# Altium schematic sheet CAN Communication.SchDoc
size A4; SheetNumber: 5; SheetTotal: 7
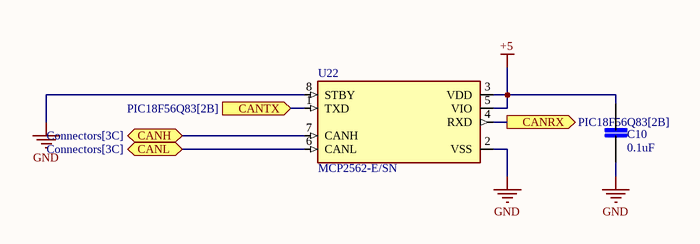
[diagram p0: CAN Communication.SchDoc]

## Parts
C10  0.1uF  [0805]
U22  MCP2562-E/SN  [MCP2562-E/SN]

## Ports
CANH (bidir, see Connectors[3C]), CANL (bidir, see Connectors[3C]), CANRX (out, see PIC18F56Q83[2B]), CANTX (in, see PIC18F56Q83[2B])

## Nets
+5: C10.2 U22.3(VDD) U22.5(VIO)
GND: C10.1 U22.2(VSS) U22.8(STBY)
CANH: U22.7(CANH) ; port CANH
CANL: U22.6(CANL) ; port CANL
CANRX: U22.4(RXD) ; port CANRX
CANTX: U22.1(TXD) ; port CANTX

## Library data of the parts
C10 = 0805_Capacitor: MP: LD051A121KAB2A; MF: AVX; SnapEDA_Link: https://www.snapeda.com/parts/LD051A121KAB2A/AVX/view-part/?ref=snap; Package: 0805 AVX; Check_prices: https://www.snapeda.com/parts/LD051A121KAB2A/AVX/view-part/?ref=eda; Purchase-URL: https://pricing.snapeda.com/search/part/LD051A121KAB2A/?ref=eda; Price: None; Value: *; Availability: In Stock
U22 = MCP2562-E/SN: 1/1 Transceiver Half CANbus 8-SOIC; MF: Microchip; Value: *; Availability: Unavailable; Package: SO-8 Microchip; Price: None; SnapEDA_Link: https://www.snapeda.com/parts/MCP2562-E/SN/Microchip/view-part/1055306/?ref=snap; MP: MCP2562-E/SN